# EAGLE design 18F Proto2 (EAGLE 6.6.0)
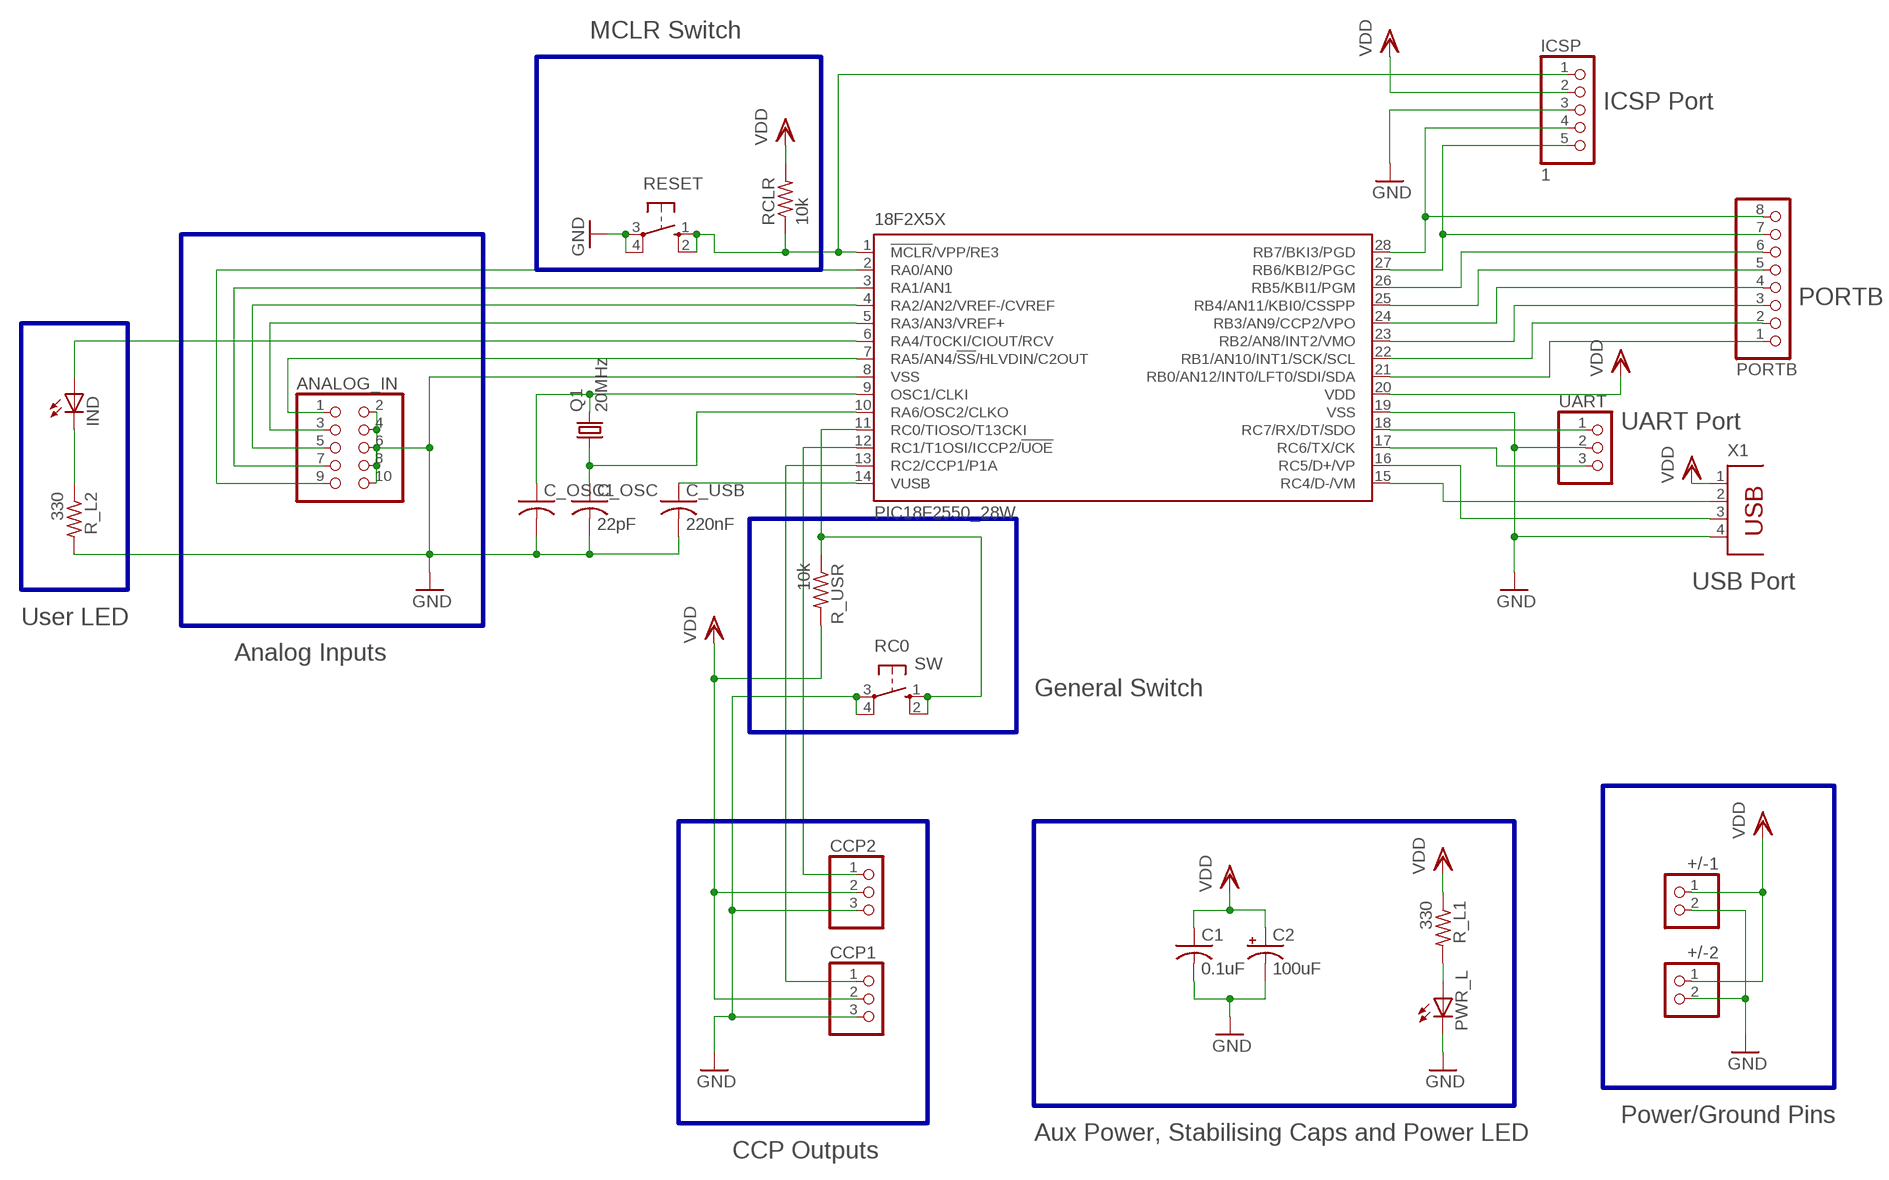
[diagram p0: schematic, sheet 1]

## Parts
18F2X5X  PIC18F2550_28W  [SO28W]
+/-1  PINHD-1X2  [1X02]
+/-2  PINHD-1X2  [1X02]
ANALOG_IN  PINHD-2X5  [2X05]
C1  0.1uF  C-US050-025X075  [C050-025X075]
C2  100uF  CPOL-USE2.5-6  [E2,5-6]
C_OSC  22pF  C-US025-025X050  [C025-025X050]
C_OSC1  C-US025-025X050  [C025-025X050]
C_USB  220nF  C-US050-025X075  [C050-025X075]
CCP1  PINHD-1X3  [1X03]
CCP2  PINHD-1X3  [1X03]
ICSP  1  PINHD-1X5  [1X05]
IND  LED3MM  [LED3MM]
PORTB  PINHD-1X8  [1X08]
PWR_L  LED3MM  [LED3MM]
Q1  20MHz  CRYSTALHC49S  [HC49/S]
R_L1  330  R-US_0204/7  [0204/7]
R_L2  330  R-US_0207/10  [0207/10]
R_USR  10k  R-US_0204/7  [0204/7]
RC0  SW  10-XX  [B3F-10XX]
RCLR  10k  R-US_0204/7  [0204/7]
RESET  10-XX  [B3F-10XX]
UART  PINHD-1X3  [1X03]
X1  PN61729  [PN61729]

## Nets
D+: 18F2X5X.16(RC5/D+/VP) X1.3
D-: 18F2X5X.15(RC4/D-/VM) X1.2
GND: 18F2X5X.8(VSS) 18F2X5X.19(VSS) +/-1.2 +/-2.2 ANALOG_IN.2 ANALOG_IN.4 ANALOG_IN.6 ANALOG_IN.8 ANALOG_IN.10 C1.2 C2.- C_OSC1.2 C_OSC.2 C_USB.2 CCP1.3 CCP2.3 ICSP.3 PWR_L.K(C) R_L2.2 RC0.3(P) RC0.4(P1) RESET.3(P) RESET.4(P1) UART.2 X1.4
MCLR: 18F2X5X.1(!MCLR!/VPP/RE3) ICSP.1 RCLR.1 RESET.1(S) RESET.2(S1)
N$4: 18F2X5X.10(RA6/OSC2/CLKO) C_OSC.1 Q1.1
N$5: PWR_L.A R_L1.2
N$7: 18F2X5X.9(OSC1/CLKI) C_OSC1.1 Q1.2
N$9: 18F2X5X.14(VUSB) C_USB.1
N$12: 18F2X5X.2(RA0/AN0) ANALOG_IN.9
N$13: 18F2X5X.3(RA1/AN1) ANALOG_IN.7
N$14: 18F2X5X.4(RA2/AN2/VREF-/CVREF) ANALOG_IN.5
N$15: 18F2X5X.5(RA3/AN3/VREF+) ANALOG_IN.3
N$16: 18F2X5X.6(RA4/T0CKI/CIOUT/RCV) IND.A
N$17: 18F2X5X.7(RA5/AN4/!SS!/HLVDIN/C2OUT) ANALOG_IN.1
N$18: IND.K(C) R_L2.1
N$19: 18F2X5X.11(RC0/TIOSO/T13CKI) R_USR.1 RC0.1(S) RC0.2(S1)
N$20: 18F2X5X.12(RC1/T1OSI/ICCP2/!UOE) CCP2.1
N$21: 18F2X5X.13(RC2/CCP1/P1A) CCP1.1
N$22: 18F2X5X.21(RB0/AN12/INT0/LFT0/SDI/SDA) PORTB.1
N$23: 18F2X5X.22(RB1/AN10/INT1/SCK/SCL) PORTB.2
N$24: 18F2X5X.23(RB2/AN8/INT2/VMO) PORTB.3
N$25: 18F2X5X.24(RB3/AN9/CCP2/VPO) PORTB.4
N$26: 18F2X5X.25(RB4/AN11/KBI0/CSSPP) PORTB.5
N$27: 18F2X5X.26(RB5/KBI1/PGM) PORTB.6
PGC: 18F2X5X.27(RB6/KBI2/PGC) ICSP.5 PORTB.7
PGD: 18F2X5X.28(RB7/BKI3/PGD) ICSP.4 PORTB.8
RX: 18F2X5X.18(RC7/RX/DT/SDO) UART.1
TX: 18F2X5X.17(RC6/TX/CK) UART.3
VDD: 18F2X5X.20(VDD) +/-1.1 +/-2.1 C1.1 C2.+ CCP1.2 CCP2.2 ICSP.2 R_L1.1 R_USR.2 RCLR.2 X1.1

## Buses
B$1
B$2
B$3
B$4
B$5
B$6
B$7

## Notes on the sheet
- MCLR Switch
- ICSP Port
- PORTB
- UART Port
- USB Port
- User LED
- Analog Inputs
- General Switch
- Power/Ground Pins
- Aux Power, Stabilising Caps and Power LED
- CCP Outputs

## Library data of the parts
18F2X5X = microchip:PIC18F2*_28: USB Microcontrollers with nanoWatt Technology High-Performance, Enhanced Flash, 28/40/44-Pin, Source: http://ww1.microchip.com/downloads/en/devicedoc/39632c.pdf; MF: MICROCHIP; MPN: PIC18F2550-I/SO; OC_FARNELL: 9321268; OC_NEWARK: 73K1297
+/-1 +/-2 = pinhead:PINHD-1X2: PIN HEADER
ANALOG_IN = pinhead:PINHD-2X5: PIN HEADER
C1 C_OSC C_OSC1 C_USB = rcl:C-US: CAPACITOR, American symbol
C2 = rcl:CPOL-US: POLARIZED CAPACITOR, American symbol
CCP1 CCP2 UART = pinhead:PINHD-1X3: PIN HEADER
ICSP = pinhead:PINHD-1X5: PIN HEADER
IND PWR_L = led:LED: LED OSRAM: - CHIPLED LG R971, LG N971, LY N971, LG Q971, LY Q971, LO R971, LY R971 LH N974, LH R974 LS Q976, LO Q976, LY Q976 LO Q996 - Hyper CHIPLED LW Q18S LB Q993, LB Q99A, LB R99A - SideLED LS A670, LO A670, LY A670, LG A670, LP A670 LB A673, LV A673, LT A673, LW A673 LH A674 LY A675 LS A676, LA A676, LO A676, LY A676, LW A676 LS A679, LY A679, LG A679 - Hyper Micro SIDELED® LS Y876, LA Y876, LO Y876, LY Y876 LT Y87S - SmartLED LW L88C, LW L88S LB L89C, LB L89S, LG L890 LS L89K, LO L89K, LY L89K LS L896, LA L896, LO L896, LY L896 - TOPLED LS T670, LO T670, LY T670, LG T670, LP T670 LSG T670, LSP T670, LSY T670, LOP T670, LYG T670 LG T671, LOG T671, LSG T671 LB T673, LV T673, LT T673, LW T673 LH T674 LS T676, LA T676, LO T676, LY T676, LB T676, LH T676, LSB T676, LW T676 LB T67C, LV T67C, LT T67C, LS T67K, LO T67K, LY T67K, LW E67C LS E67B, LA E67B, LO E67B, LY E67B, LB E67C, LV E67C, LT E67C LW T67C LS T679, LY T679, LG T679 LS T770, LO T770, LY T770, LG T770, LP T770 LB T773, LV T773, LT T773, LW T773 LH T774 LS E675, LA E675, LY E675, LS T675 LS T776, LA T776, LO T776, LY T776, LB T776 LHGB T686 LT T68C, LB T68C - Hyper Mini TOPLED® LB M676 - Mini TOPLED Santana® LG M470 LS M47K, LO M47K, LY M47K Source: http://www.osram.convergy.de LUXEON: - LUMILED® LXK2-PW12-R00, LXK2-PW12-S00, LXK2-PW14-U00, LXK2-PW14-V00 LXK2-PM12-R00, LXK2-PM12-S00, LXK2-PM14-U00 LXK2-PE12-Q00, LXK2-PE12-R00, LXK2-PE12-S00, LXK2-PE14-T00, LXK2-PE14-U00 LXK2-PB12-K00, LXK2-PB12-L00, LXK2-PB12-M00, LXK2-PB14-N00, LXK2-PB14-P00, LXK2-PB14-Q00 LXK2-PR12-L00, LXK2-PR12-M00, LXK2-PR14-Q00, LXK2-PR14-R00 LXK2-PD12-Q00, LXK2-PD12-R00, LXK2-PD12-S00 LXK2-PH12-R00, LXK2-PH12-S00 LXK2-PL12-P00, LXK2-PL12-Q00, LXK2-PL12-R00 Source: www.luxeon.com KINGBRIGHT: KA-3528ASYC Source: www.kingbright.com
PORTB = pinhead:PINHD-1X8: PIN HEADER
Q1 = crystal:CRYSTAL: CRYSTAL; OC_FARNELL: 1667008; OC_NEWARK: unknown
R_L1 R_L2 R_USR RCLR = rcl:R-US_: RESISTOR, American symbol
RC0 RESET = switch-omron:10-XX: OMRON SWITCH; MPN: B3F-1000; OC_FARNELL: 176432; OC_NEWARK: 36M3542
X1 = con-berg:PN61729: BERG USB connector; OC_FARNELL: unknown; OC_NEWARK: unknown

## Board
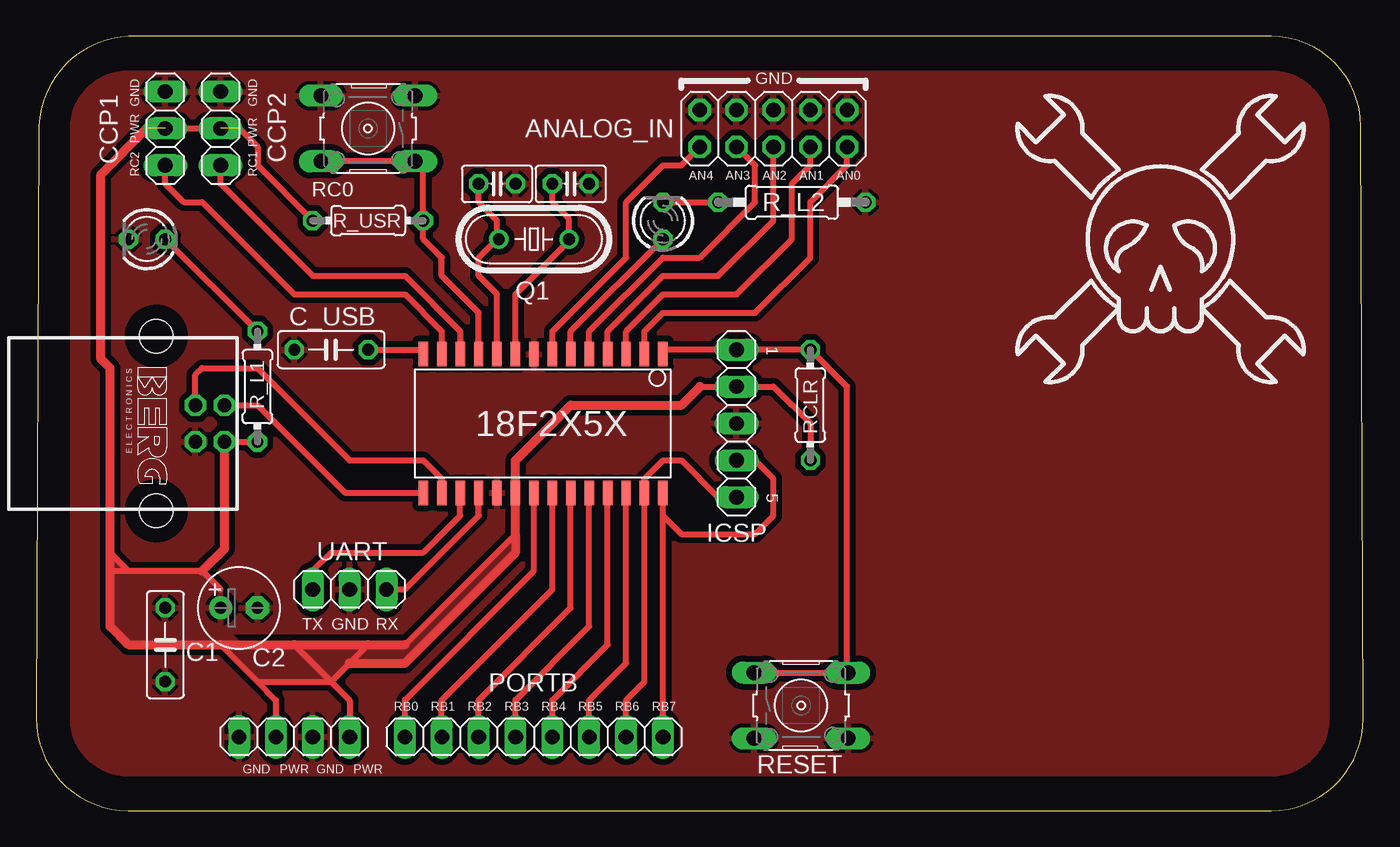
[diagram p1: board, top side]

Size 91.44 x 53.34 mm. Coordinates in mm from the lower left corner, seen from the top.
Outline: 85.09,0 arc90 91.44,6.34 91.27,47.15 arc90 85.09,53.34 6.98,53.34 arc90 0.17,47.15 0,6.34 arc90 6.35,0 85.09,0
Copper layers (1*16): Top 0.035mm / dielectric 1.5mm / Bottom 0.035mm
Design rules "default": minimum track width 10mil, minimum drill 24mil, track to track 8mil, track to pad 8mil, pad to pad 8mil, via to via 8mil, smd to smd 8mil, copper to edge 40mil, drill to drill 8mil, minimum pad ring 10mil, minimum via ring 8mil, stop-mask expansion 4mil, vias tented up to drill 0mil, thermal gap 10mil

### Footprints (pad centres in the part's own frame; a part is rotated, then mirrored left to right if it is on the bottom)
SO28W = smd 0.65 x 1.7: 1 -7.62,-4.78; 2 -6.35,-4.78; 3 -5.08,-4.78; 4 -3.81,-4.78; 5 -2.54,-4.78; 6 -1.27,-4.78; 7 0,-4.78; 8 1.27,-4.78; 9 2.54,-4.78; 10 3.81,-4.78; 11 5.08,-4.78; 12 6.35,-4.78; 13 7.62,-4.78; 14 8.89,-4.78; 15 8.89,4.78; 16 7.62,4.78; 17 6.35,4.78; 18 5.08,4.78; 19 3.81,4.78; 20 2.54,4.78; 21 1.27,4.78; 22 0,4.78; 23 -1.27,4.78; 24 -2.54,4.78; 25 -3.81,4.78; 26 -5.08,4.78; 27 -6.35,4.78; 28 -7.62,4.78
1X02 = drill 1.016 long: 1 -1.27,0; 2 1.27,0
2X05 = drill 1.016 octagon: 1 -5.08,-1.27; 2 -5.08,1.27; 3 -2.54,-1.27; 4 -2.54,1.27; 5 0,-1.27; 6 0,1.27; 7 2.54,-1.27; 8 2.54,1.27; 9 5.08,-1.27; 10 5.08,1.27
C050-025X075 = drill 0.813 octagon: 1 -2.54,0; 2 2.54,0
E2,5-6 = drill 0.813 pad 1.6: + -1.27,0 | drill 0.813 pad 1.6 octagon: - 1.27,0
C025-025X050 = drill 0.813 octagon: 1 -1.27,0; 2 1.27,0
1X03 = drill 1.016 long: 1 -2.54,0; 2 0,0; 3 2.54,0
1X05 = drill 1.016 long: 1 -5.08,0; 2 -2.54,0; 3 0,0; 4 2.54,0; 5 5.08,0
LED3MM = drill 0.813 octagon: A -1.27,0; K 1.27,0
1X08 = drill 1.016 long: 1 -8.89,0; 2 -6.35,0; 3 -3.81,0; 4 -1.27,0; 5 1.27,0; 6 3.81,0; 7 6.35,0; 8 8.89,0
HC49/S = drill 0.813: 1 -2.413,0; 2 2.413,0
0204/7 = drill 0.813 octagon: 1 -3.81,0; 2 3.81,0
0207/10 = drill 0.813 octagon: 1 -5.08,0; 2 5.08,0
B3F-10XX = drill 1.016 long: 1 -3.251,2.261; 2 3.251,2.261; 3 -3.251,-2.261; 4 3.251,-2.261
PN61729 = drill 0.95 octagon: 1 1.25,4.71; 2 -1.25,4.71; 3 -1.25,2.71; 4 1.25,2.71 | hole 2.3: -6.02,0; 6.02,0

### Placement (x,y rotation side)
18F2X5X  35.56,26.66 180 top
+/-1  15.24,5.08 180 top
+/-2  20.32,5.08 180 top
ANALOG_IN  50.8,46.98 0 top
C1  8.89,11.43 270 top
C2  13.97,13.96 0 top
C_OSC  31.75,43.17 0 top
C_OSC1  36.83,43.17 0 top
C_USB  20.32,31.75 180 top
CCP1  8.89,46.98 90 top
CCP2  12.7,46.98 90 top
ICSP  48.26,26.66 270 top
IND  43.18,40.63 90 top
PORTB  34.29,5.08 0 top
PWR_L  7.62,39.37 180 top
Q1  34.29,39.37 0 top
R_L1  15.24,29.21 90 top
R_L2  52.07,41.91 0 top
R_USR  22.86,40.63 180 top
RC0  22.86,46.98 180 top
RCLR  53.34,27.94 270 top
RESET  52.71,7.23 0 top
U$1  [HACKADAY_S]  77.47,39.37 0 top
UART  21.59,15.24 180 top
X1  8.26,26.66 270 top

### Tracks (layer width: path | path; a pad name or v marks a point on that pad's centre or on a via)
D+
  Top 0.406: X1.3 10.96,30.01 11.43,30.48 15.24,30.48 21.59,24.12 26.67,24.12 27.94,22.86 18F2X5X.16
D-
  Top 0.406: X1.2 15.26,27.91 21.29,21.89 18F2X5X.15
  Top 0.61: 18F2X5X.15 26.67,21.59
GND
  pour Top (isolate 0.406): 2.54,46.98 arc-90 6.35,50.8 85.09,50.8 arc-90 88.9,46.98 88.9,6.34 arc-90 85.09,2.54 6.35,2.54 arc-90 2.54,6.34
MCLR
  Top 0.406: 55.88,10.16 55.88,29.21 RCLR.1 ICSP.1 43.18,31.75 | RESET.1 55.22,9.5 55.88,10.16 | RESET.2 55.96,10.08 55.88,10.16
  Top 0.61: 43.18,31.75 18F2X5X.1
N$4
  Top 0.406: 18F2X5X.10 31.75,35.55 30.48,36.83 30.48,38.09 31.75,39.37 | 31.75,39.37 Q1.1 | 31.75,39.37 31.75,40.63 30.48,41.91 C_OSC.1
N$5
  Top 0.406: R_L1.2 PWR_L.A
N$7
  Top 0.406: 18F2X5X.9 33.02,35.55 36.83,39.37 | 36.83,39.37 Q1.2 | 36.83,39.37 36.7,39.49 36.7,40.76 35.56,41.91 C_OSC1.1
N$9
  Top 0.406: C_USB.1 26.67,31.75
  Top 0.61: 26.67,31.75 18F2X5X.14
N$12
  Top 0.406: 18F2X5X.2 41.91,33.02 43.18,34.29 49.53,34.29 53.34,38.09 53.34,41.91 55.88,44.45 ANALOG_IN.9
N$13
  Top 0.406: 18F2X5X.3 40.64,33.02 43.18,35.55 48.26,35.55 52.07,39.37 52.07,43.17 53.34,44.45 ANALOG_IN.7
N$14
  Top 0.406: 18F2X5X.4 39.37,33.02 43.18,36.83 46.99,36.83 50.8,40.63 ANALOG_IN.5
N$15
  Top 0.406: 18F2X5X.5 38.1,33.02 43.18,38.09 45.72,38.09 49.53,41.91 49.53,44.45 ANALOG_IN.3
N$16
  Top 0.406: 18F2X5X.6 36.83,33.02 IND.A
N$17
  Top 0.406: 18F2X5X.7 35.56,33.02 40.64,38.09 40.64,41.91 43.18,44.45 44.45,44.45 ANALOG_IN.1
N$18
  Top 0.406: IND.K R_L2.1
N$19
  Top 0.406: 18F2X5X.11 30.48,34.29 27.94,36.83 27.94,38.09 26.67,39.37 R_USR.1 26.67,44.45 26.39,44.72 RC0.1 RC0.2
N$20
  Top 0.406: 18F2X5X.12 29.21,33.02 25.4,36.83 19.05,36.83 12.7,43.17 CCP2.1
N$21
  Top 0.406: 18F2X5X.13 27.94,33.02 25.4,35.55 17.78,35.55 11.43,41.91 10.16,41.91 8.89,43.17 CCP1.1
N$22
  Top 0.406: 18F2X5X.21 34.29,16.5 25.4,7.61 PORTB.1
N$23
  Top 0.406: 18F2X5X.22 35.56,15.24 27.94,7.61 PORTB.2
N$24
  Top 0.406: 18F2X5X.23 36.83,13.96 30.48,7.61 PORTB.3
N$25
  Top 0.406: 18F2X5X.24 38.1,12.7 33.02,7.61 PORTB.4
N$26
  Top 0.406: 18F2X5X.25 39.37,11.43 35.56,7.61 PORTB.5
N$27
  Top 0.406: 18F2X5X.26 40.64,10.16 38.1,7.61 PORTB.6
PGC
  Top 0.406: ICSP.5 46.99,21.59 44.45,24.12 43.18,24.12 41.91,22.86 18F2X5X.27 41.91,8.88 40.64,7.61 PORTB.7
PGD
  Top 0.406: 43.18,20.32 18F2X5X.28 | 43.18,20.32 44.45,19.05 49.53,19.05 50.8,20.32 50.8,22.86 49.53,24.12 ICSP.4 | PORTB.8 43.18,20.32
RX
  Top 0.406: 18F2X5X.18 30.48,20.32 25.4,15.24 UART.1
TX
  Top 0.406: 18F2X5X.17 29.21,20.32 26.67,17.78 20.32,17.78 19.05,16.5 UART.3
VDD  (2 unrouted)
  Top 0.406: 12.7,11.43 15.24,8.88 | 15.24,8.88 16.51,7.61 +/-1.1 | 17.78,11.43 20.32,8.88 | 20.32,8.88 21.59,7.61 +/-2.1 | 12.7,15.24 11.43,16.5 6.35,16.5 | 5.08,16.5 6.35,16.5 | 15.24,8.88 20.32,8.88 | 20.32,8.88 21.59,10.16 22.86,11.43 | 5.08,17.78 6.35,16.5 | 25.4,11.43 33.02,19.05 | 7.62,46.98 13.97,46.98 15.24,45.72 15.24,44.45 R_USR.2 | 45.72,29.21 ICSP.2 50.8,29.21 53.34,26.66 RCLR.2 | X1.1 15.22,25.41 R_L1.1
  Top 0.61: 18F2X5X.20 33.02,21.59 | 7.62,46.98 4.45,43.81 4.45,31.11 5.08,30.48 5.08,17.78 5.08,13.96 | 18F2X5X.20 33.02,19.05 33.02,17.78 25.4,10.16 21.59,10.16 | 25.4,11.43 22.86,11.43 17.78,11.43 12.7,11.43 6.35,11.43 5.08,12.7 5.08,13.96 | 5.08,13.96 5.08,16.5 | 18F2X5X.20 33.02,24.12 36.83,27.94 44.45,27.94 45.72,29.21 | X1.1 12.96,18.04 11.43,16.5
  pour Top: 5.08,17.78 5.08,12.7 6.35,11.43 12.7,11.43 15.24,8.88 20.32,8.88 21.59,10.16 25.4,10.16 33.02,17.78 33.02,19.05 25.4,11.43 13.97,11.43 12.7,12.7 12.7,15.24 11.43,16.5 6.35,16.5

### Text on the board
tNames: GND | GND | GND | PWR | PWR | RC2 | RC1 | AN4 | AN3 | AN2 | AN1 | AN0 | 1 | 5 | TX | GND | RX | RB0 | RB1 | RB2 | RB3 | RB4 | RB5 | RB6 | RB7 | GND | PWR | GND | PWR